# EasyEDA Pro project foc_board.eprj

# Schematic Schematic1
Board Name: Board1; Create Date: 2024-08-11; Page Name: P1; Project Name: foc_board; Schematic Name: Schematic1; Update Date: 2025-01-14; Company: 嘉立创EDA; Page Size: A4; Version: V1.0
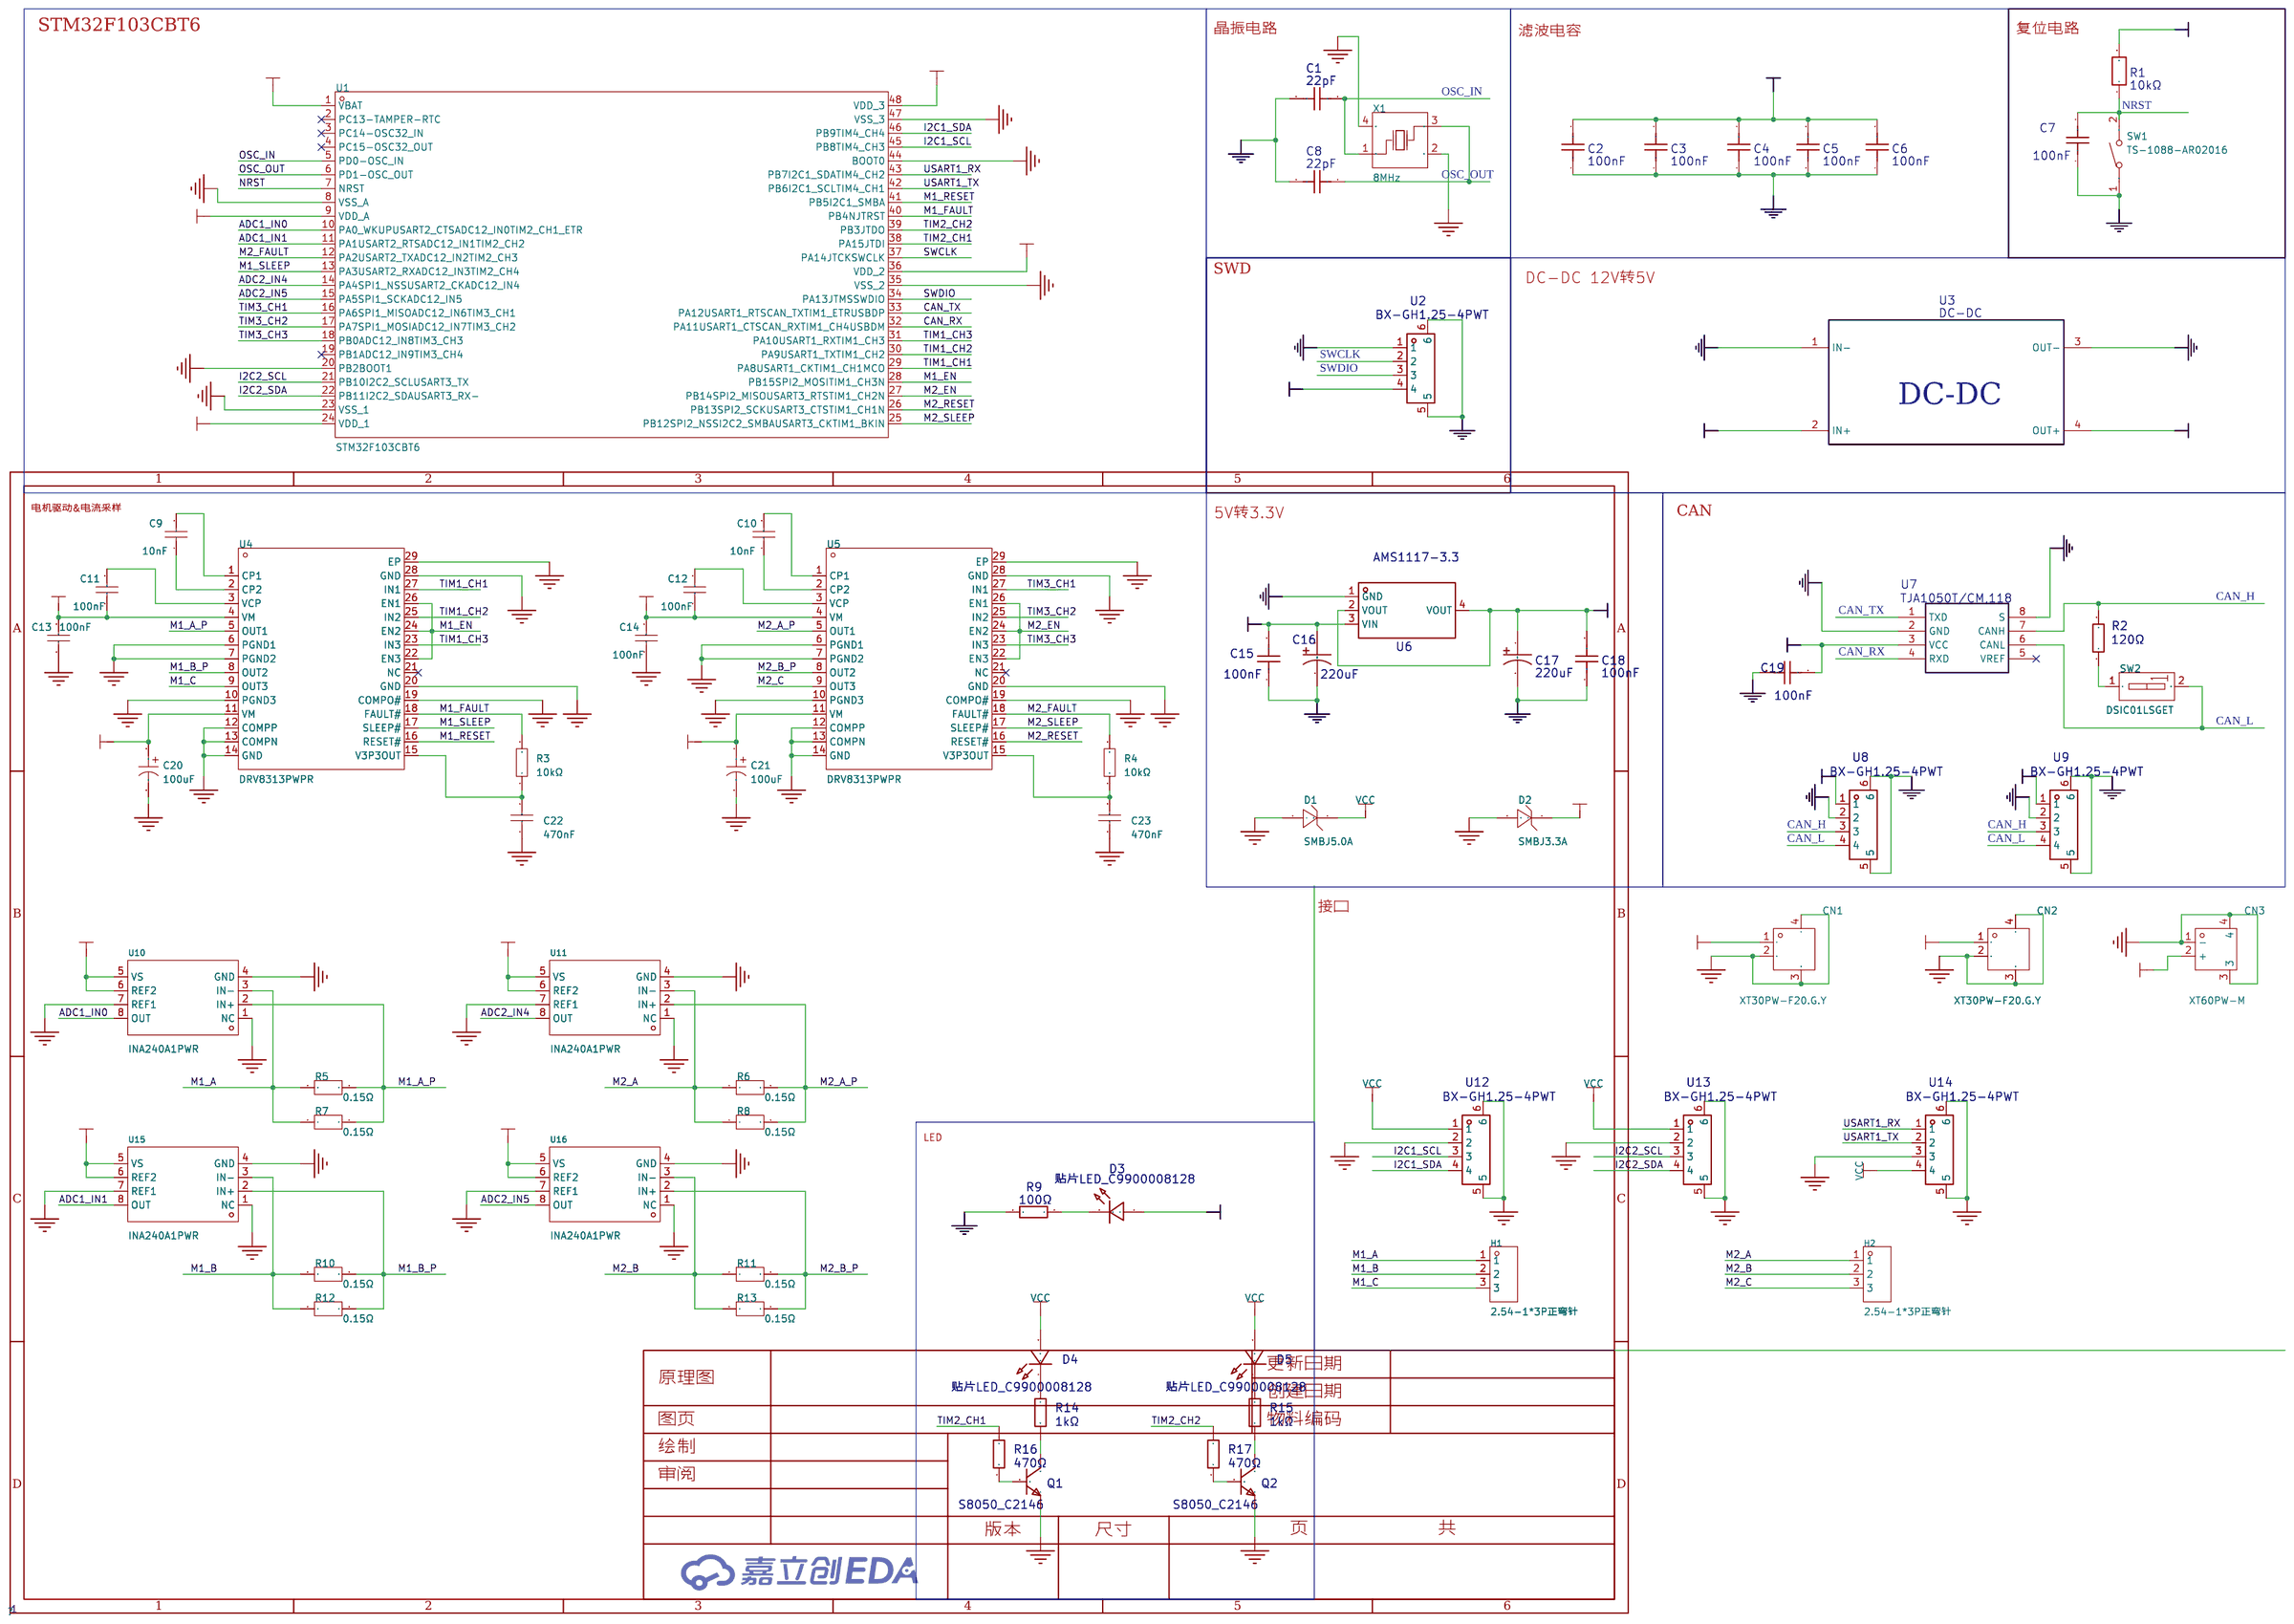
[diagram p0: schematic sheet]

## Parts
C1  22pF  [C0603]
C2  100nF  [C0603]
C3  100nF  [C0603]
C4  100nF  [C0603]
C5  100nF  [C0603]
C6  100nF  [C0603]
C7  100nF  [C0603]
C8  22pF  [C0603]
C9  10nF  [C0603]
C10  10nF  [C0603]
C11  100nF  [C0603]
C12  100nF  [C0603]
C13  100nF  [C0603]
C14  100nF  [C0603]
C15  100nF  [C0603]
C16  220uF  [CAP-SMD_BD6.3-L6.6-W6.6-FD]
C17  220uF  [CAP-SMD_BD6.3-L6.6-W6.6-FD]
C18  100nF  [C0603]
C19  100nF  [C0603]
C20  100uF  [CAP-SMD_BD6.3-L6.6-W6.6-LS7.4-FD]
C21  100uF  [CAP-SMD_BD6.3-L6.6-W6.6-LS7.4-FD]
C22  470nF  [C0603]
C23  470nF  [C0603]
CN1  XT30PW-F20.G.Y  [CONN-TH_XT30PW-F-1]
CN2  XT30PW-F20.G.Y  [CONN-TH_XT30PW-F-1]
CN3  XT60PW-M  [CONN-TH_XT60PW-M]
D1  SMBJ5.0A  [SMB_L4.6-W3.6-LS5.3-RD]
D2  SMBJ3.3A  [SMB_L4.6-W3.6-LS5.3-RD]
D3  贴片LED_C9900008128  [LED0603-RD]
D4  贴片LED_C9900008128  [LED0603-RD]
D5  贴片LED_C9900008128  [LED0603-RD]
H1  2.54-1*3P正弯针  [HDR-TH_3P-P2.54-H-M-BW7.2-P]
H2  2.54-1*3P正弯针  [HDR-TH_3P-P2.54-H-M-BW7.2-P]
Q1  S8050_C2146  [SOT-23-3_L3.0-W1.7-P0.95-LS2.9-BR]
Q2  S8050_C2146  [SOT-23-3_L3.0-W1.7-P0.95-LS2.9-BR]
R1  10kΩ  [R0603]
R2  120Ω  [R0805]
R3  10kΩ  [R0603]
R4  10kΩ  [R0603]
R5  0.15Ω  [R1812]
R6  0.15Ω  [R1812]
R7  0.15Ω  [R1812]
R8  0.15Ω  [R1812]
R9  100Ω  [R0805]
R10  0.15Ω  [R1812]
R11  0.15Ω  [R1812]
R12  0.15Ω  [R1812]
R13  0.15Ω  [R1812]
R14  1kΩ  [R0805]
R15  1kΩ  [R0805]
R16  470Ω  [R0805]
R17  470Ω  [R0805]
SW1  TS-1088-AR02016  [SW-SMD_L3.9-W3.0-P4.45]
SW2  DSIC01LSGET  [SW-SMD_DSIC01LSGET]
U1  STM32F103CBT6  [LQFP-48_L7.0-W7.0-P0.50-LS9.0-BL]
U2  BX-GH1.25-4PWT  [CONN-SMD_4P-P1.25_BX-GH1.25-4PWT]
U3  DC-DC  [DC-DC]
U4  DRV8313PWPR  [HTSSOP-28_L9.8-W4.5-P0.65-LS6.6-BL-EP]
U5  DRV8313PWPR  [HTSSOP-28_L9.8-W4.5-P0.65-LS6.6-BL-EP]
U6  AMS1117-3.3  [SOT-223-3_L6.5-W3.4-P2.30-LS7.0-BR]
U7  TJA1050T/CM,118  [SOIC-8_L5.0-W4.0-P1.27-LS6.0-BL]
U8  BX-GH1.25-4PWT  [CONN-SMD_4P-P1.25_BX-GH1.25-4PWT]
U9  BX-GH1.25-4PWT  [CONN-SMD_4P-P1.25_BX-GH1.25-4PWT]
U10  INA240A1PWR  [TSSOP-8_L4.4-W3.0-P0.65-LS6.4-BL]
U11  INA240A1PWR  [TSSOP-8_L4.4-W3.0-P0.65-LS6.4-BL]
U12  BX-GH1.25-4PWT  [CONN-SMD_4P-P1.25_BX-GH1.25-4PWT]
U13  BX-GH1.25-4PWT  [CONN-SMD_4P-P1.25_BX-GH1.25-4PWT]
U14  BX-GH1.25-4PWT  [CONN-SMD_4P-P1.25_BX-GH1.25-4PWT]
U15  INA240A1PWR  [TSSOP-8_L4.4-W3.0-P0.65-LS6.4-BL]
U16  INA240A1PWR  [TSSOP-8_L4.4-W3.0-P0.65-LS6.4-BL]
X1  8MHz  [OSC-SMD_4P-L5.0-W3.2-BL]

## Library data of the parts
C1 C8 = 22pF: Supplier: LCSC; Supplier Part: C2266794; Manufacturer: Knowles(楼氏); Manufacturer Part: 0603J0250104KXR; JLCPCB Part Class: Extended Part
C2-C7 C15 C18 C19 = 100nF: Supplier: LCSC; Supplier Part: C2266794; Manufacturer: Knowles(楼氏); Manufacturer Part: 0603J0250104KXR; JLCPCB Part Class: Extended Part
C9-C14 = CC0603KRX7R9BB103: LCSC Part Name: 10nF ±10% 50V; Supplier Part: C100042; Manufacturer: YAGEO(国巨); Supplier Footprint: 0603; JLCPCB Part Class: 扩展库; Datasheet: https://atta.szlcsc.com/upload/public/pdf/source/20181008/C309510_22F155564471FAF6A489F7D68F34234E.pdf; Supplier: LCSC; Tolerance: ±10%; Voltage Rated: 50V; Temperature Coefficient: X7R
C16 C17 = 220uF: Supplier: LCSC; Supplier Part: C165593; Manufacturer: SAMYOUNG(韩国三莹); Manufacturer Part: MVK 16V220M 6.3*8 6.3TP; JLCPCB Part Class: Extended Part
C20 C21 = RVT100UF35V67RV0034: LCSC Part Name: 100uF ±20% 35V; Supplier Part: C2836442; Manufacturer: KNSCHA(科尼盛); Supplier Footprint: SMD,D6.3xL7.7mm; JLCPCB Part Class: 扩展库; Datasheet: https://atta.szlcsc.com/upload/public/pdf/source/20210528/C2836442_7F6389BF36F63F32D6DF3A507E8E95D6.pdf; Supplier: LCSC; Tolerance: ±20%; Rated Voltage: 35V; Ripple Current: 87mA@120kHz; φD: 6.3mm; L: 7.7mm; Lifetime @ Temp: 2000hrs@105℃; Operating Temperature: -55℃~+105℃
C22 C23 = CL10B474KA8NNNC: LCSC Part Name: 470nF ±10% 25V; Supplier Part: C1623; Manufacturer: SAMSUNG(三星); Supplier Footprint: 0603; JLCPCB Part Class: 基础库; Datasheet: https://atta.szlcsc.com/upload/public/pdf/source/20160218/1457707763339.pdf; Supplier: LCSC; Tolerance: ±10%; Voltage Rated: 25V; Temperature Coefficient: X7R
CN1 CN2 = XT30PW-F20.G.Y: LCSC Part Name: AMASS(艾迈斯)电源连接器 母头 XT30PW-F; Supplier Part: C2913282; Manufacturer: AMASS(艾迈斯); JLCPCB Part Class: 扩展库; Datasheet: https://atta.szlcsc.com/upload/public/pdf/source/20231218/06CFCF98887A9A87638B0856A725C8FD.pdf; Supplier: LCSC; Type: 航模插头; InterfaceType: 母头
CN3 = XT60PW-M: LCSC Part Name: AMASS(艾迈斯)航模插头xt60连接器150公母对接pw锂电池公头 板插卧式XT60PW-M; Supplier Part: C98732; Manufacturer: AMASS(艾迈斯); JLCPCB Part Class: 扩展库; Datasheet: https://atta.szlcsc.com/upload/public/pdf/source/20240118/44A3DCFF53BE25DC65378AFFB21277A4.pdf; Supplier: LCSC; Brand: 艾迈斯; Type: 卧式插头; Colour: 黄色; InterfaceType: 公头
D1 = SMBJ5.0A_C113974: 反向截止电压(Vrwm):5V;最大钳位电压:9.2V;峰值脉冲电流(Ipp)@10/1000us:65.2A;击穿电压:6.4V;; LCSC Part Name: TVS 5V截止 65.22A峰值脉冲; Supplier Part: C113974; Manufacturer: MDD; Supplier Footprint: SMB(DO-214AA); JLCPCB Part Class: 扩展库; Datasheet: https://atta.szlcsc.com/upload/public/pdf/source/20230314/C8F66EF07395B88C11214ABD10019202.pdf; Supplier: LCSC; Reverse Stand-Off Voltage (Vrwm): 5V; Maximum Clamping Voltage: 9.2V; Peak Pulse Current (Ipp)@10/1000us: 65.2A; Breakdown Voltage: 6.4V; Type: TVS
D2 = SMBJ3.3A_C362089: 反向截止电压(Vrwm):3.3V;最大钳位电压:7.3V;峰值脉冲功率(Ppp)@10/1000us:600W;击穿电压:4.1V;; LCSC Part Name: 单向TVS 3.3V截止 600W峰值脉冲功率; Supplier Part: C113974; Manufacturer: JKSEMI(金开盛); Supplier Footprint: SMB(DO-214AA); JLCPCB Part Class: 扩展库; Datasheet: https://atta.szlcsc.com/upload/public/pdf/source/20200731/C362089_3B984BF84356FE4A5051ADB3F5B1E766.pdf; Supplier: LCSC; Reverse Stand-Off Voltage (Vrwm): 3.3V; Maximum Clamping Voltage: 7.3V; Peak Pulse Power Dissipation (Ppp)@10/1000us: 600W; Breakdown Voltage: 4.1V; Type: TVS
D3-D5 = 贴片LED_C9900008128: Supplier: LCSC; Supplier Part: C9900008128; Manufacturer: null; Manufacturer Part: 贴片LED
H1 H2 = 2.54-1*3P正弯针: LCSC Part Name: 间距:2.54mm 1x3P 弯插 方针; Supplier Part: C92159; Manufacturer: BOOMELE(博穆精密); Supplier Footprint: 弯插,P=2.54mm; JLCPCB Part Class: 扩展库; Datasheet: https://atta.szlcsc.com/upload/public/pdf/source/20181121/C2334_B051029C4931EB562F9DCCAAD18AC88A.pdf; Supplier: LCSC; Pin Structure: 1x3P; Pitch: 2.54mm; Circluar Pins/Square Pins: 方针; Mounting Type: 弯插; Number of Rows: 单排; Number of Pins: 3P; Current Rating (Max): 3A; Length of Mating Pin: 3mm; Insulation Height: 2.54mm; Operating Temperature Range: -55℃~+105℃; Color: 黑色
Q1 Q2 = S8050_C2146: Supplier: LCSC; Manufacturer: CJ(江苏长电/长晶); Manufacturer Part: S8050 J3Y; Supplier Part: C2146; JLCPCB Part Class: Basic Part
R1 = 10kΩ: Supplier: LCSC; Supplier Part: C20138101; Manufacturer: VISHAY(威世); Manufacturer Part: MCT0603MG1002BP500; JLCPCB Part Class: Extended Part
R2 = 120Ω: Supplier: LCSC; Manufacturer: YAGEO(国巨); Manufacturer Part: RC0805FR-07120RL; Supplier Part: C114245; JLCPCB Part Class: Extended Part
R3 R4 = 0603WAF1002T5E: LCSC Part Name: 厚膜电阻 10kΩ ±1% 100mW; Supplier Part: C25804; Manufacturer: UNI-ROYAL(厚声); Supplier Footprint: 0603; JLCPCB Part Class: 基础库; Datasheet: https://atta.szlcsc.com/upload/public/pdf/source/20200306/C422600_1E6D84923E4A46A82E41ADD87F860B5C.pdf; Supplier: LCSC; Type: 厚膜电阻; Tolerance: ±1%; Power(Watts): 100mW; Overload Voltage (Max): 75V; Temperature Coefficient: ±100ppm/℃; Operating Temperature Range: -55℃~+155℃
R5-R8 R10-R13 = FRC1812J101 TS: LCSC Part Name: 100Ω ±5% 750mW 厚膜电阻; Supplier Part: C2933911; Manufacturer: FOJAN(富捷); Supplier Footprint: 1812; JLCPCB Part Class: 扩展库; Datasheet: https://atta.szlcsc.com/upload/public/pdf/source/20211221/925EC7D7225764EE0046F22065062C87.pdf; Supplier: LCSC; Type: 厚膜电阻; Tolerance: ±5%; Power(Watts): 750mW; Overload Voltage (Max): 200V; Temperature Coefficient: ±100ppm/℃; Operating Temperature Range: -55℃~+155℃
R9 R14-R17 = 1kΩ: Supplier: LCSC; Manufacturer: YAGEO(国巨); Manufacturer Part: RC0805FR-07120RL; Supplier Part: C114245; JLCPCB Part Class: Extended Part
SW1 = TS-1088-AR02016: 电路结构:单刀单掷;按钮形状:圆形按钮;作用力:160gf;安装方式:立贴;开关长度:4mm;开关宽度:3mm;开关高度:2mm;带支架:不带;触点电流:50mA;额定电压(DC):12V;绝缘电阻:100MΩ;机械寿命:10万次;; LCSC Part Name: 4*3*2mm 立贴 轻触开关; Supplier Part: C720477; Manufacturer: XUNPU(讯普); Supplier Footprint: SMD; JLCPCB Part Class: 扩展库; Datasheet: https://atta.szlcsc.com/upload/public/pdf/source/20200810/C720475_60D09DD6C54279ADDB2DC25100F1CC11.pdf; Supplier: LCSC; Circuit: 单刀单掷; Actuator Style: 圆形按钮; Operating Force: 160gf; Mounting Style: 立贴; Switch Length: 4mm; Switch Width: 3mm; Switch Height: 2mm; Strike Gundam: 不带; Contact Current: 50mA; Voltage Rating (DC): 12V; Insulation Resistance: 100MΩ; Actuator/Cap Color: 黑色; Pin Style: SMD接片; Mechanical Life: 10万次; Operating Temperature: -30℃~+80℃
SW2 = DSIC01LSGET_C54948: LCSC Part Name: 1位高推 拨码开关; Supplier Part: C54948; Manufacturer: YE; Supplier Footprint: SMD,2.5x6mm; JLCPCB Part Class: 扩展库; Datasheet: https://atta.szlcsc.com/upload/public/pdf/source/20150928/1457707425459.pdf; Supplier: LCSC; Type: 平拨,凸起式; Circuit: 单刀单掷; Number of Positions: 1位; Color: 黑色
U1 = STM32F103CBT6: LCSC Part Name: 主流增强型ARM Cortex-M3 MCU，具有128 KB Flash、72 MHz CPU、电机控制、USB和CAN; Supplier Part: C8304; Manufacturer: ST(意法半导体); Supplier Footprint: LQFP-48(7x7); JLCPCB Part Class: 扩展库; Datasheet: https://atta.szlcsc.com/upload/public/pdf/source/20150811/1457707344439.pdf; Supplier: LCSC; CPU Core: ARM-M3; Program Storage Size: 128KB; RAM Size: 20KB; GPIO Ports Number: 37; Operating Voltage Range: 2V~3.6V; CPU Maximum Speed: 72MHz; Program Memory Type: FLASH; Operating Temperature Range: -40℃~+85℃; ADC (Bit): 12bit; Universal Serial Bus: 有; Peripheral/Function: DMA；温度传感器；PWM; Watchdog: 有; Infrared Data Association: 有; Low-Voltage Detect: 有; Direct Memory Access: 有; Internal Oscillator: 有
U2 U8 U9 U12-U14 = BX-GH1.25-4PWT: Supplier: LCSC; Supplier Part: C18077720; Manufacturer: Bossie(博锡); JLCPCB Part Class: Extended Part
U3 = DC-DC: Supplier Part: C2875440
U4 U5 = DRV8313PWPR: LCSC Part Name: 无刷直流BLDC电机驱动芯片 60V; Supplier Part: C92482; Manufacturer: TI(德州仪器); Supplier Footprint: HTSSOP-28-EP-4.5mm; JLCPCB Part Class: 扩展库; Datasheet: https://www.ti.com/cn/lit/gpn/drv8313; Supplier: LCSC
U6 = AMS1117-3.3: Supplier: LCSC; Manufacturer: AMS; Supplier Part: C6186; JLCPCB Part Class: Basic Part
U7 = TJA1050T/CM,118: Supplier: LCSC; Manufacturer: NXP(恩智浦); Supplier Part: C6952; JLCPCB Part Class: Extended Part
U10 U11 U15 U16 = INA240A1PWR: Supplier Part: C93965; Manufacturer: TI(德州仪器); Supplier Footprint: TSSOP-8; JLCPCB Part Class: 扩展库; Datasheet: https://www.ti.com/cn/lit/gpn/ina240; Supplier: LCSC; Number of Channels: 单路; Supply Current: 1.8mA; Operating Temperature: -40℃~+125℃
X1 = X50328MSB4SI: LCSC Part Name: 8MHz ±10ppm 20pF; Supplier Part: C157341; Manufacturer: YXC(扬兴晶振); Supplier Footprint: SMD5032-4P; JLCPCB Part Class: 扩展库; Datasheet: https://atta.szlcsc.com/upload/public/pdf/source/20240329/327CA683A00C8316374FE0D2B6DB5109.pdf; Supplier: LCSC; Crystal Type: 贴片晶振; Normal temperature Frequency Tolerance: ±10ppm; External load capacitor: 20pF; Frequency Stability(Full temperature range): ±20ppm; Operating Temperature: -40℃~+85℃

## Nets
GND: C1.2 C2.1 C3.1 C4.1 C5.1 C6.1 C7.1 C8.2 C15.1 C16.2 C17.2 C18.1 C19.2 C22.1 C23.1 D1.2(A) D2.2 Q1.2(E) Q2.2(E) R9.2 SW1.1 U1.8(VSS_A) U1.20(PB2BOOT1) U1.23(VSS_1) U1.35(VSS_2) U1.44(BOOT0) U1.47(VSS_3) U2.1 U2.5 U2.6 U3.3(OUT-) U4.12(COMPP) U4.13(COMPN) U4.14(GND) U4.19(COMPO#) U4.20(GND) U4.28(GND) U5.12(COMPP) U5.13(COMPN) U5.14(GND) U5.19(COMPO#) U5.20(GND) U5.28(GND) U6.1(GND) U7.2(GND) U7.8(S) U8.2 U8.5 U8.6 U9.2 U9.5 U9.6 U10.1(NC) U10.4(GND) U10.7(REF1) U11.1(NC) U11.4(GND) U11.7(REF1) U12.2 U12.5 U12.6 U13.2 U13.5 U13.6 U14.3 U14.5 U14.6 U15.1(NC) U15.4(GND) U15.7(REF1) U16.1(NC) U16.4(GND) U16.7(REF1) X1.2(GND) X1.4(GND)
PGND: C13.1 C14.1 C20.2 C21.2 CN1.2 CN1.3 CN1.4 CN2.2 CN2.3 CN2.4 CN3.1(-) CN3.3 CN3.4 U3.1(IN-) U4.6(PGND1) U4.7(PGND2) U4.10(PGND3) U4.29(EP) U5.6(PGND1) U5.7(PGND2) U5.10(PGND3) U5.29(EP)
VCC: C15.2 C16.1 C19.1 D1.1(C) D3.2 D4.2 D5.2 U3.4(OUT+) U6.3(VIN) U7.3(VCC) U8.1 U9.1 U12.1 U13.1 U14.4
VCC3.3: C2.2 C3.2 C4.2 C5.2 C6.2 C17.1 C18.2 D2.1 R1.2 U1.1(VBAT) U1.9(VDD_A) U1.24(VDD_1) U1.36(VDD_2) U1.48(VDD_3) U2.4 U6.2(VOUT) U6.4(VOUT) U10.5(VS) U10.6(REF2) U11.5(VS) U11.6(REF2) U15.5(VS) U15.6(REF2) U16.5(VS) U16.6(REF2)
VCC12V: C11.1 C12.1 C13.2 C14.2 C20.1 C21.1 CN1.1 CN2.1 CN3.2(+) U3.2(IN+) U4.4(VM) U4.11(VM) U5.4(VM) U5.11(VM)
ADC1_IN0: U1.10(PA0_WKUPUSART2_CTSADC12_IN0TIM2_CH1_ETR) U10.8(OUT)
ADC1_IN1: U1.11(PA1USART2_RTSADC12_IN1TIM2_CH2) U15.8(OUT)
ADC2_IN4: U1.14(PA4SPI1_NSSUSART2_CKADC12_IN4) U11.8(OUT)
ADC2_IN5: U1.15(PA5SPI1_SCKADC12_IN5) U16.8(OUT)
CAN_H: R2.2 U7.7(CANH) U8.3 U9.3
CAN_L: SW2.2(A2) U7.6(CANL) U8.4 U9.4
CAN_RX: U1.32(PA11USART1_CTSCAN_RXTIM1_CH4USBDM) U7.4(RXD)
CAN_TX: U1.33(PA12USART1_RTSCAN_TXTIM1_ETRUSBDP) U7.1(TXD)
I2C1_SCL: U1.45(PB8TIM4_CH3) U12.3
I2C1_SDA: U1.46(PB9TIM4_CH4) U12.4
I2C2_SCL: U1.21(PB10I2C2_SCLUSART3_TX) U13.3
I2C2_SDA: U1.22(PB11I2C2_SDAUSART3_RX-) U13.4
M1_A: H1.1 R5.1 R7.1 U10.3(IN-)
M1_A_P: R5.2 R7.2 U4.5(OUT1) U10.2(IN+)
M1_B: H1.2 R10.1 R12.1 U15.3(IN-)
M1_B_P: R10.2 R12.2 U4.8(OUT2) U15.2(IN+)
M1_C: H1.3 U4.9(OUT3)
M1_EN: U1.28(PB15SPI2_MOSITIM1_CH3N) U4.22(EN3) U4.24(EN2) U4.26(EN1)
M1_FAULT: R3.2 U1.40(PB4NJTRST) U4.18(FAULT#)
M1_RESET: U1.41(PB5I2C1_SMBA) U4.16(RESET#)
M1_SLEEP: U1.13(PA3USART2_RXADC12_IN3TIM2_CH4) U4.17(SLEEP#)
M2_A: H2.1 R6.1 R8.1 U11.3(IN-)
M2_A_P: R6.2 R8.2 U5.5(OUT1) U11.2(IN+)
M2_B: H2.2 R11.1 R13.1 U16.3(IN-)
M2_B_P: R11.2 R13.2 U5.8(OUT2) U16.2(IN+)
M2_C: H2.3 U5.9(OUT3)
M2_EN: U1.27(PB14SPI2_MISOUSART3_RTSTIM1_CH2N) U5.22(EN3) U5.24(EN2) U5.26(EN1)
M2_FAULT: R4.2 U1.12(PA2USART2_TXADC12_IN2TIM2_CH3) U5.18(FAULT#)
M2_RESET: U1.26(PB13SPI2_SCKUSART3_CTSTIM1_CH1N) U5.16(RESET#)
M2_SLEEP: U1.25(PB12SPI2_NSSI2C2_SMBAUSART3_CKTIM1_BKIN) U5.17(SLEEP#)
NRST: C7.2 R1.1 SW1.2 U1.7(NRST)
OSC_IN: C1.1 U1.5(PD0-OSC_IN) X1.1(OSC1)
OSC_OUT: C8.1 U1.6(PD1-OSC_OUT) X1.3(OSC2)
SWCLK: U1.37(PA14JTCKSWCLK) U2.2
SWDIO: U1.34(PA13JTMSSWDIO) U2.3
TIM1_CH1: U1.29(PA8USART1_CKTIM1_CH1MCO) U4.27(IN1)
TIM1_CH2: U1.30(PA9USART1_TXTIM1_CH2) U4.25(IN2)
TIM1_CH3: U1.31(PA10USART1_RXTIM1_CH3) U4.23(IN3)
TIM2_CH1: R16.1 U1.38(PA15JTDI)
TIM2_CH2: R17.1 U1.39(PB3JTDO)
TIM3_CH1: U1.16(PA6SPI1_MISOADC12_IN6TIM3_CH1) U5.27(IN1)
TIM3_CH2: U1.17(PA7SPI1_MOSIADC12_IN7TIM3_CH2) U5.25(IN2)
TIM3_CH3: U1.18(PB0ADC12_IN8TIM3_CH3) U5.23(IN3)
USART1_RX: U1.43(PB7I2C1_SDATIM4_CH2) U14.1
USART1_TX: U1.42(PB6I2C1_SCLTIM4_CH1) U14.2
$1N3655: R2.1 SW2.1(A1)
$1N7193: C9.2 U4.1(CP1)
$1N7199: C9.1 U4.2(CP2)
$1N7239: C11.2 U4.3(VCP)
$1N7723: C22.2 R3.1 U4.15(V3P3OUT)
$1N8422: C10.2 U5.1(CP1)
$1N8426: C10.1 U5.2(CP2)
$1N8429: C12.2 U5.3(VCP)
$1N8490: C23.2 R4.1 U5.15(V3P3OUT)
$1N11780: D3.1 R9.1
$1N11915: Q2.3(C) R15.2
$1N11916: D5.1 R15.1
$1N11923: Q2.1(B) R17.2
$1N12054: Q1.3(C) R14.2
$1N12055: D4.1 R14.1
$1N12058: Q1.1(B) R16.2

Not connected (* = marked no-connect by the designer): U1 2(PC13-TAMPER-RTC)* 3(PC14-OSC32_IN)* 4(PC15-OSC32_OUT)* 19(PB1ADC12_IN9TIM3_CH4)*; U4 21(NC)*; U5 21(NC)*; U7 5(VREF)*

## Notes on the sheet
- STM32F103CBT6
- 晶振电路
- 滤波电容
- 复位电路
- SWD
- DC-DC 12V转5V
- 电机驱动&电流采样
- 5V转3.3V
- CAN
- 接口
- LED

# Board PCB1
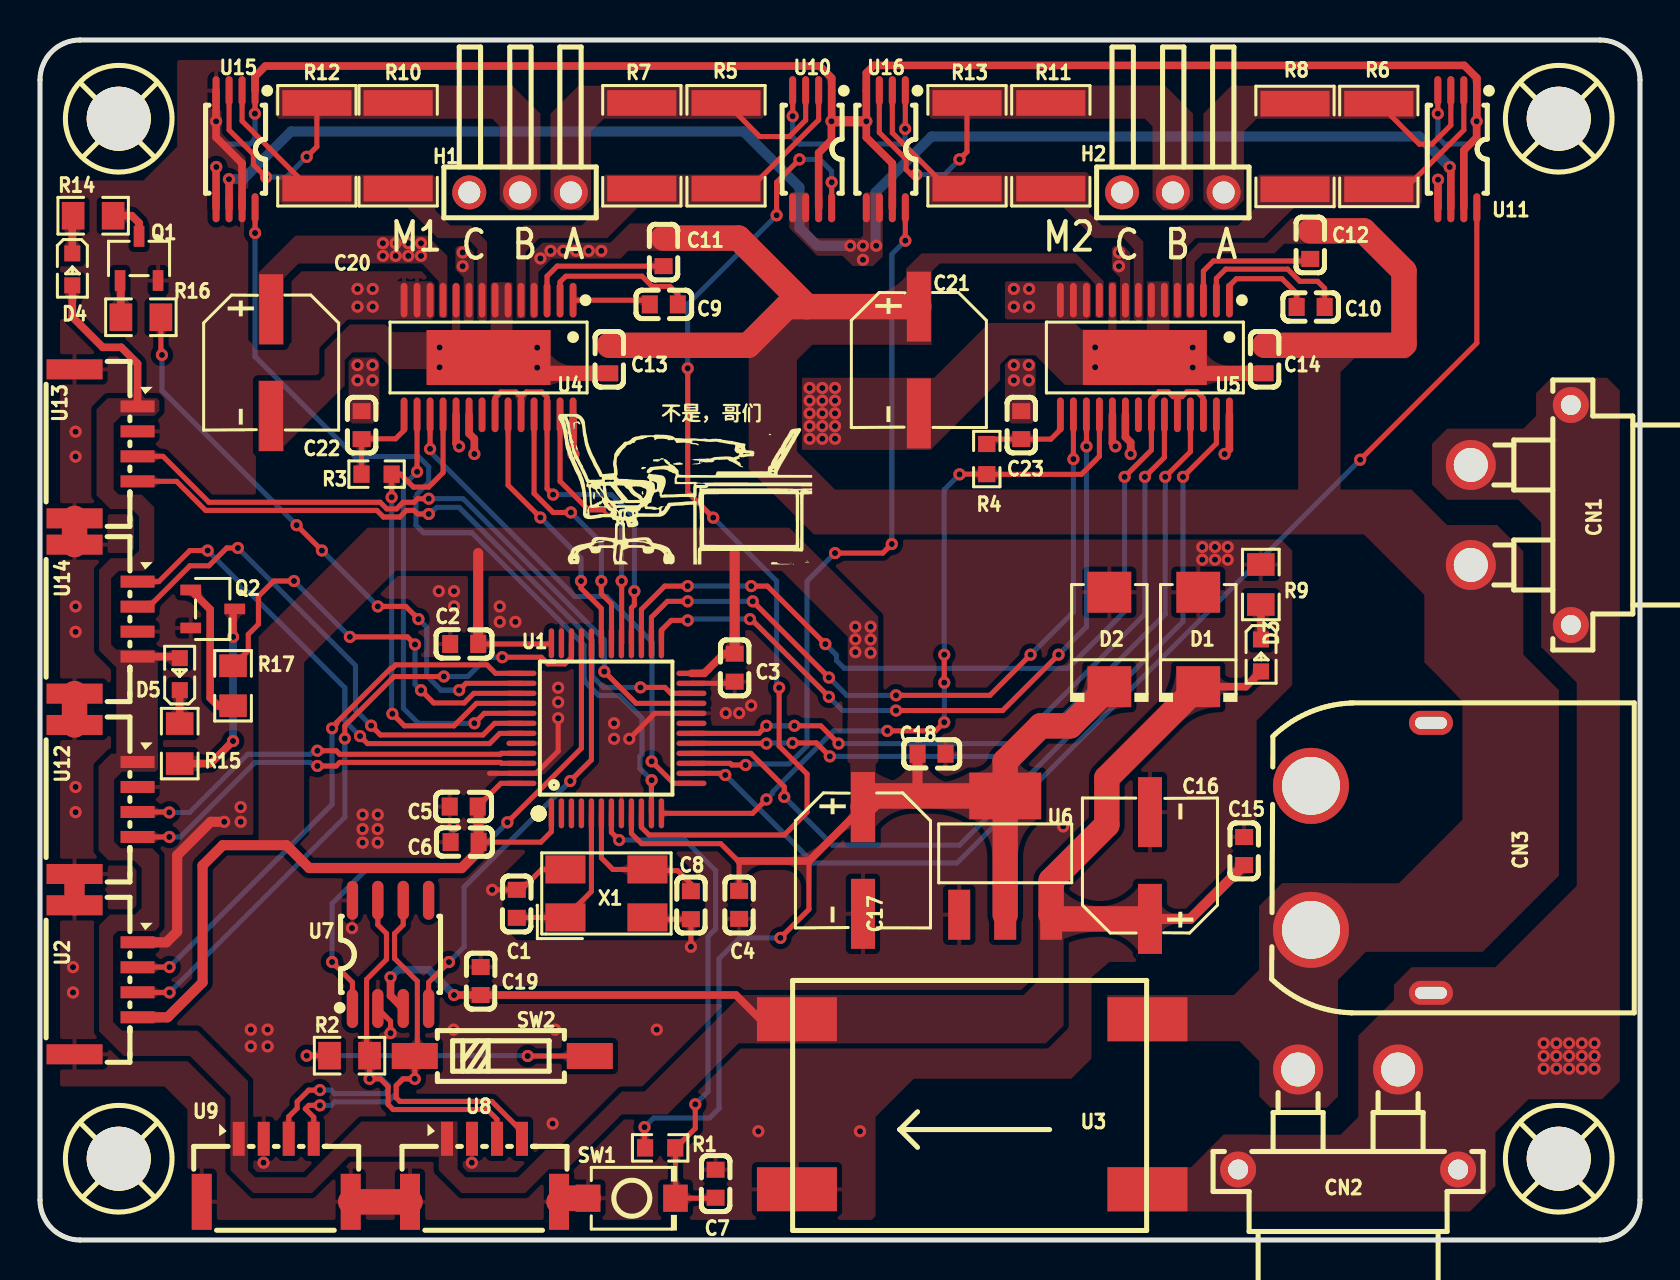
[diagram p1: board, top side]
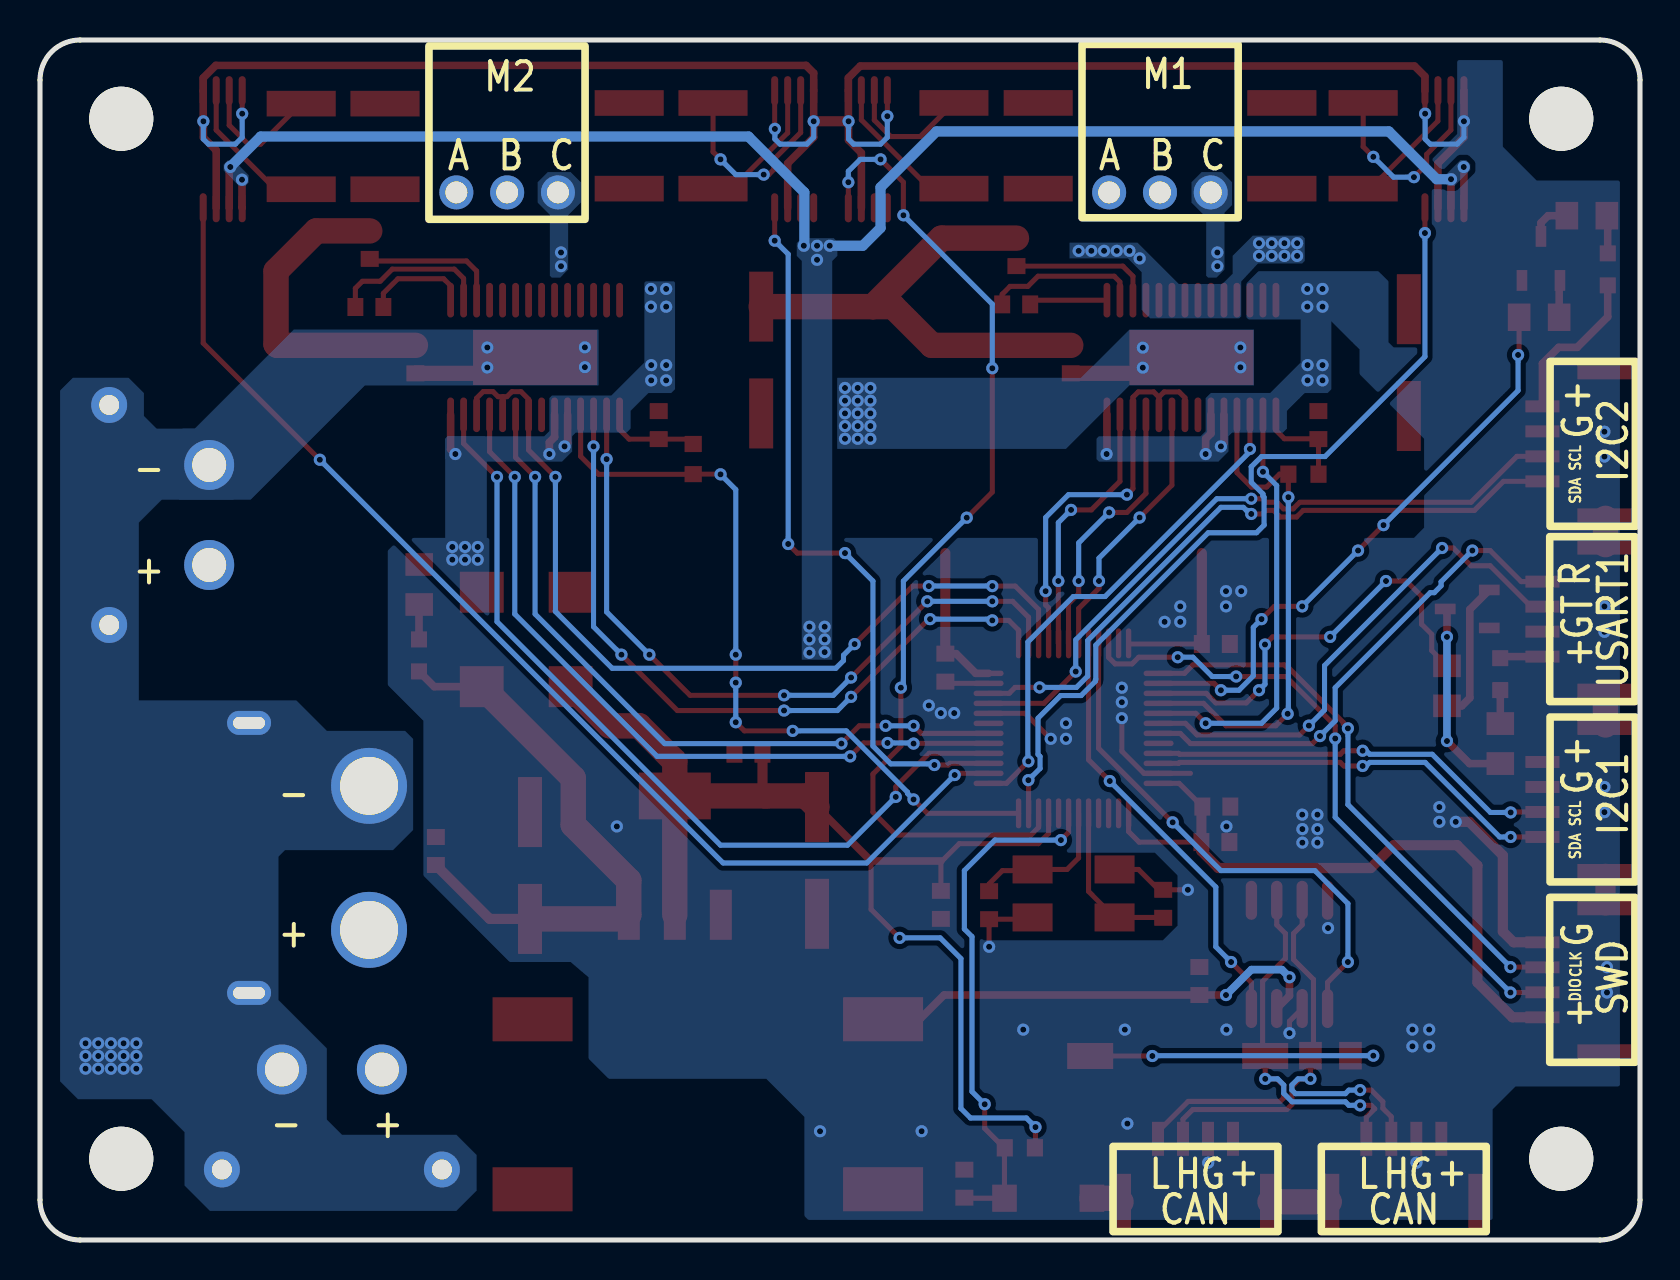
[diagram p2: board, bottom side, seen from below]

Outline 80 x 60 mm; copper layers: Top Layer, Bottom Layer. Coordinates in mm from the lower left corner of the outline.
Outline path: 0,58 0,2 arc(0.59,0.59) 2,0 78,0 arc(79.41,0.59) 80,2 80,58 arc(79.41,59.41) 78,60 2,60 arc(0.59,59.41) 0,58
Stack: Top Layer 0.035mm / Dielectric1 1.51mm FR4 er 4.5 / Bottom Layer 0.035mm

## Design rules (mm)
net OSC_IN: DP1
net OSC_OUT: DP1
net CAN_H: DP4
net CAN_L: DP4
net I2C2_SCL: DP2
net I2C2_SDA: DP2
net I2C1_SCL: DP3
net I2C1_SDA: DP3
template: 自定义配置
spacing copperThickness1oz: track to track 0.102, other pairs 0.152 to 0.3
spacing copperThickness2oz: track to track 0.203, other pairs 0.152 to 0.3
spacing Default (default): track to track 0.152, other pairs 0 to 1.001
track width copperThickness1oz: min 0.127, default 0.254, max 2.54
track width copperThickness2oz: min 0.203, default 0.254, max 2.54
track width Default (default): min 0.254, default 0.254, max 25.4
differential pair differentialPair (default): width min 0.127, default 0.254, max 2.54; gap min 0.152, default 0.152
via viaSize (default): diameter min 0.5, default 0.61, max 10; hole min 0.3, default 0.305, max 6.3
via Default: diameter min 0.61, default 0.61, max 100.025; hole min 0.305, default 0.305, max 59.995
net GND uses Default

## Placement (name value [footprint] x y rotation side)
C1  22pF  [C0603]  23.84 16.81 90 top
C2  100nF  [C0603]  21.21 29.8 0 top
C3  100nF  [C0603]  34.73 28.62 90 top
C4  100nF  [C0603]  34.96 16.76 90 top
C5  100nF  [C0603]  21.19 21.67 0 top
C6  100nF  [C0603]  21.23 19.89 0 top
C7  100nF  [C0603]  33.78 2.81 270 top
C8  22pF  [C0603]  32.54 16.74 270 top
C9  10nF  [C0603]  31.19 46.78 180 top
C10  10nF  [C0603]  63.53 46.65 180 top
C11  100nF  [C0603]  31.18 49.39 270 top
C12  100nF  [C0603]  63.51 49.75 270 top
C13  100nF  [C0603]  28.46 44.03 90 top
C14  100nF  [C0603]  61.23 44.03 90 top
C15  100nF  [C0603]  60.21 19.45 270 top
C16  220uF  [CAP-SMD_BD6.3-L6.6-W6.6-FD]  55.5 18.72 90 top
C17  220uF  [CAP-SMD_BD6.3-L6.6-W6.6-FD]  41.15 18.98 270 top
C18  100nF  [C0603]  44.58 24.31 180 top
C19  100nF  [C0603]  22.03 12.95 90 top
C20  100uF  [CAP-SMD_BD6.3-L6.6-W6.6-LS7.4-FD]  11.56 43.87 270 top
C21  100uF  [CAP-SMD_BD6.3-L6.6-W6.6-LS7.4-FD]  43.94 44 270 top
C22  470nF  [C0603]  16.08 40.74 270 top
C23  470nF  [C0603]  49.06 40.74 270 top
CN1  XT30PW-F20.G.Y  [CONN-TH_XT30PW-F-1]  74.04 36.25 90 top
CN2  XT30PW-F20.G.Y  [CONN-TH_XT30PW-F-1]  65.41 6.03 0 top
CN3  XT60PW-M  [CONN-TH_XT60PW-M]  66.55 19.11 180 top
D1  SMBJ5.0A  [SMB_L4.6-W3.6-LS5.3-RD]  57.91 30.03 90 top
D2  SMBJ3.3A  [SMB_L4.6-W3.6-LS5.3-RD]  53.47 30.03 90 top
D3  贴片LED_C9900008128  [LED0603-RD]  61.05 29.23 270 top
D4  贴片LED_C9900008128  [LED0603-RD]  1.61 48.53 270 top
D5  贴片LED_C9900008128  [LED0603-RD]  6.99 28.29 90 top
H1  2.54-1*3P正弯针  [HDR-TH_3P-P2.54-H-M-BW7.2-P]  24 52.38 180 top
H2  2.54-1*3P正弯针  [HDR-TH_3P-P2.54-H-M-BW7.2-P]  56.64 52.38 180 top
Q1  S8050_C2146  [SOT-23-3_L3.0-W1.7-P0.95-LS2.9-BR]  4.95 49.08 270 top
Q2  S8050_C2146  [SOT-23-3_L3.0-W1.7-P0.95-LS2.9-BR]  8.64 31.55 180 top
R1  10kΩ  [R0603]  31.01 4.61 180 top
R2  120Ω  [R0805]  15.48 9.22 0 top
R3  10kΩ  [R0603]  16.83 38.29 0 top
R4  10kΩ  [R0603]  47.34 39.05 270 top
R5  0.15Ω  [R1812]  34.3 54.71 270 top
R6  0.15Ω  [R1812]  66.94 54.68 270 top
R7  0.15Ω  [R1812]  30.09 54.71 270 top
R8  0.15Ω  [R1812]  62.75 54.68 270 top
R9  100Ω  [R0805]  61.04 32.77 90 top
R10  0.15Ω  [R1812]  17.91 54.71 270 top
R11  0.15Ω  [R1812]  50.54 54.71 270 top
R12  0.15Ω  [R1812]  13.84 54.71 270 top
R13  0.15Ω  [R1812]  46.35 54.71 270 top
R14  1kΩ  [R0805]  2.66 51.21 0 top
R15  1kΩ  [R0805]  6.98 24.82 270 top
R16  470Ω  [R0805]  5.04 46.14 180 top
R17  470Ω  [R0805]  9.65 27.71 270 top
SCREW1  -  [M3螺丝]  4 4 0 top
SCREW2  -  [M3螺丝]  4 56 0 top
SCREW3  -  [M3螺丝]  76 56 0 top
SCREW4  -  [M3螺丝]  76 4 0 top
SW1  TS-1088-AR02016  [SW-SMD_L3.9-W3.0-P4.45]  29.59 2.09 0 top
SW2  DSIC01LSGET  [SW-SMD_DSIC01LSGET]  23.11 9.2 270 top
U1  STM32F103CBT6  [LQFP-48_L7.0-W7.0-P0.50-LS9.0-BL]  28.32 25.58 0 top
U2  BX-GH1.25-4PWT  [CONN-SMD_4P-P1.25_BX-GH1.25-4PWT]  3.3 13.01 270 top
U3  -  [DC-DC]  46.61 6.79 180 top
U4  DRV8313PWPR  [HTSSOP-28_L9.8-W4.5-P0.65-LS6.6-BL-EP]  22.43 44.12 180 top
U5  DRV8313PWPR  [HTSSOP-28_L9.8-W4.5-P0.65-LS6.6-BL-EP]  55.25 44.12 180 top
U6  AMS1117-3.3  [SOT-223-3_L6.5-W3.4-P2.30-LS7.0-BR]  48.26 19.23 270 top
U7  TJA1050T/CM,118  [SOIC-8_L5.0-W4.0-P1.27-LS6.0-BL]  17.53 14.28 0 top
U8  BX-GH1.25-4PWT  [CONN-SMD_4P-P1.25_BX-GH1.25-4PWT]  22.22 3.49 0 top
U9  BX-GH1.25-4PWT  [CONN-SMD_4P-P1.25_BX-GH1.25-4PWT]  11.81 3.49 0 top
U10  INA240A1PWR  [TSSOP-8_L4.4-W3.0-P0.65-LS6.4-BL]  38.61 54.54 180 top
U11  INA240A1PWR  [TSSOP-8_L4.4-W3.0-P0.65-LS6.4-BL]  70.87 54.54 180 top
U12  BX-GH1.25-4PWT  [CONN-SMD_4P-P1.25_BX-GH1.25-4PWT]  3.3 22.03 270 top
U13  BX-GH1.25-4PWT  [CONN-SMD_4P-P1.25_BX-GH1.25-4PWT]  3.3 39.81 270 top
U14  BX-GH1.25-4PWT  [CONN-SMD_4P-P1.25_BX-GH1.25-4PWT]  3.3 31.04 270 top
U15  INA240A1PWR  [TSSOP-8_L4.4-W3.0-P0.65-LS6.4-BL]  9.78 54.54 180 top
U16  INA240A1PWR  [TSSOP-8_L4.4-W3.0-P0.65-LS6.4-BL]  42.29 54.54 180 top
X1  8MHz  [OSC-SMD_4P-L5.0-W3.2-BL]  28.32 17.33 0 top

## Footprints (pads in the part's own frame, mm; a bottom-side part is the same pattern mirrored in y, then rotated)
C0603
  rect 0.8x0.9 smd: 1(-0.7,0) 2(0.7,0)
CAP-SMD_BD6.3-L6.6-W6.6-FD
  rect 3.5x1.2 smd: 1(-2.67,0) 2(2.67,0)
CAP-SMD_BD6.3-L6.6-W6.6-LS7.4-FD
  rect 3.5x1.2 smd: 1(-2.67,0) 2(2.67,0)
CONN-SMD_4P-P1.25_BX-GH1.25-4PWT
  rect 0.6x1.7 smd: 1(-1.875,1.575) 2(-0.625,1.575) 3(0.625,1.575) 4(1.875,1.575)
  rect 1x2.8 smd: 5(3.725,-1.575) 6(-3.725,-1.575)
CONN-TH_XT30PW-F-1
  round 2.5 hole 1.7: 1(-2.5,2.5) 2(2.5,2.5)
  round 1.8 hole 1: 3(5.5,-2.5) 4(-5.5,-2.5)
CONN-TH_XT60PW-M
  round 3.8 hole 2.9: 1(3,-3.6) 2(3,3.6)
  oval 2.2x1.2 hole 1.6x0.6: 3(-3,6.75) 4(-3,-6.75)
DC-DC
  rect 4x2.2 smd: 1(-8.763,4.25) 2(-8.763,-4.25) 3(8.763,4.25) 4(8.763,-4.25)
HDR-TH_3P-P2.54-H-M-BW7.2-P
  round 1.7 hole 1.1: 1(-2.54,0) 2(0,0) 3(2.54,0)
HTSSOP-28_L9.8-W4.5-P0.65-LS6.6-BL-EP
  oval 0.343x1.732 smd: 1(-4.225,-2.866) 2(-3.575,-2.866) 3(-2.925,-2.866) 4(-2.275,-2.866) 5(-1.625,-2.866) 6(-0.975,-2.866) 7(-0.325,-2.866) 8(0.325,-2.866) 9(0.975,-2.866) 10(1.625,-2.866) 11(2.275,-2.866) 12(2.925,-2.866) 13(3.575,-2.866) 14(4.225,-2.866) 15(4.225,2.866) 16(3.575,2.866) 17(2.925,2.866) 18(2.275,2.866) 19(1.625,2.866) 20(0.975,2.866) 21(0.325,2.866) 22(-0.325,2.866) 23(-0.975,2.866) 24(-1.625,2.866) 25(-2.275,2.866) 26(-2.925,2.866) 27(-3.575,2.866) 28(-4.225,2.866)
  rect 6.2x2.75 smd: 29(0,0)
LED0603-RD
  rect 0.8x0.8 smd: 1(-0.799,0) 2(0.799,0)
LQFP-48_L7.0-W7.0-P0.50-LS9.0-BL
  oval 0.27x1.5 smd: 1(-2.75,-4.25) 2(-2.25,-4.25) 3(-1.75,-4.25) 4(-1.25,-4.25) 5(-0.75,-4.25) 6(-0.25,-4.25) 7(0.25,-4.25) 8(0.75,-4.25) 9(1.25,-4.25) 10(1.75,-4.25) 11(2.25,-4.25) 12(2.75,-4.25) 25(2.75,4.25) 26(2.25,4.25) 27(1.75,4.25) 28(1.25,4.25) 29(0.75,4.25) 30(0.25,4.25) 31(-0.25,4.25) 32(-0.75,4.25) 33(-1.25,4.25) 34(-1.75,4.25) 35(-2.25,4.25) 36(-2.75,4.25)
  oval 1.5x0.27 smd: 13(4.25,-2.75) 14(4.25,-2.25) 15(4.25,-1.75) 16(4.25,-1.25) 17(4.25,-0.75) 18(4.25,-0.25) 19(4.25,0.25) 20(4.25,0.75) 21(4.25,1.25) 22(4.25,1.75) 23(4.25,2.25) 24(4.25,2.75) 37(-4.25,2.75) 38(-4.25,2.25) 39(-4.25,1.75) 40(-4.25,1.25) 41(-4.25,0.75) 42(-4.25,0.25) 43(-4.25,-0.25) 44(-4.25,-0.75) 45(-4.25,-1.25) 46(-4.25,-1.75) 47(-4.25,-2.25) 48(-4.25,-2.75)
M3螺丝
  round 3.2 hole 3.2: 1(-0.064,0.064)
OSC-SMD_4P-L5.0-W3.2-BL
  rect 2x1.4 smd: 1(-2.05,-1.2) 2(2.05,-1.2) 3(2.05,1.2) 4(-2.05,1.2)
R0603
  rect 0.806x0.864 smd: 1(-0.753,0) 2(0.753,0)
R0805
  rect 1.133x1.377 smd: 1(-1,0) 2(1,0)
R1812
  rect 1.282x3.456 smd: 1(-2.141,0) 2(2.141,0)
SMB_L4.6-W3.6-LS5.3-RD
  rect 2.047x2.192 smd: 1(-2.361,0) 2(2.361,0)
SOIC-8_L5.0-W4.0-P1.27-LS6.0-BL
  oval 0.569x1.95 smd: 1(-1.905,-2.705) 2(-0.635,-2.705) 3(0.635,-2.705) 4(1.905,-2.705) 5(1.905,2.705) 6(0.635,2.705) 7(-0.635,2.705) 8(-1.905,2.705)
SOT-23-3_L3.0-W1.7-P0.95-LS2.9-BR
  rect 1.038x0.532 smd: 1(1.101,-0.95) 2(1.101,0.95) 3(-1.101,0)
SOT-223-3_L6.5-W3.4-P2.30-LS7.0-BR
  rect 2.5x1.1 smd: 1(2.97,-2.3) 2(2.97,0) 3(2.97,2.3)
  rect 2.34x3.6 smd: 4(-2.97,0)
SW-SMD_DSIC01LSGET
  rect 1.3x2.3 smd: 1(0,4.375) 2(0,-4.375)
SW-SMD_L3.9-W3.0-P4.45
  rect 1.23x1.36 smd: 1(-2.185,0) 2(2.185,0)
TSSOP-8_L4.4-W3.0-P0.65-LS6.4-BL
  oval 0.353x1.454 smd: 1(-0.975,-2.927) 2(-0.325,-2.927) 3(0.325,-2.927) 4(0.975,-2.927) 5(0.975,2.927) 6(0.325,2.927) 7(-0.325,2.927) 8(-0.975,2.927)

## Nets
As in the schematic.

Pads without a net: SCREW1 1; SCREW2 1; SCREW3 1; SCREW4 1; U1 2 3 4 19; U4 21; U5 21; U7 5

## Via types
v1: diameter 0.61, hole 0.305, Top Layer to Bottom Layer, 266 vias

## Routing (per net, layer and track width the routed paths; a pad name or vN(x,y) marks a point on that pad's centre or on a via; arc(x,y) is an arc through that point)
GND: length 161.5
  Top Layer w0.254: X1.2 30.46,16.04 C8.2 v1(32.54,14.66) ; C3.1 34.65,27.83 U1.23 ; v1(22.61,17.51) C1.2 24.06,17.51 25.08,18.53 X1.4 ; 22.48,23.33 U1.47 24.8,23.33 25.91,24.44 v1(25.91,26.09) ; U1.20 30.74,26.33 v1(29.46,25.06) ; U11.4 v1(69.89,56.32) ; U10.4 v1(37.63,56.19) ; U16.1 43.27,55.56 v1(43.26,55.56) ; v1(10.74,56.32) 10.75,56.33 U15.1 ; 16.89,11.57 17.53,10.94 v1(17.53,10.34)
  Top Layer w0.381: U11.7 71.19,54.48 71.83,55.12 v1(71.83,55.94) 71.84,55.95 U11.1 71.84,58.1 71.21,58.73 41.7,58.73 41.32,58.35 U16.4 v1(41.32,55.94) 41.32,55.13 42.62,53.83 U16.7 ; v1(59.23,39.3) 59.47,39.54 U5.28 ; U5.20 54.27,40.15 54.53,39.88 v1(54.53,39.3) ; U15.1 10.75,58.18 11.27,58.7 38.99,58.7 39.58,58.1 U10.1 39.58,55.95 v1(39.57,55.94) 39.57,55 38.93,54.36 U10.7 ; U5.19 53.62,39.83 v1(53.77,39.68) ; U4.19 20.8,39.83 v1(20.96,39.68) ; v1(21.72,39.3) 21.72,40.06 21.45,40.33 U4.20 ; U15.7 10.1,53.83 8.8,55.13 v1(8.8,55.94) U15.4 ; v1(26.67,39.3) 26.65,39.32 U4.28
  Top Layer w0.508: v1(39.57,55.94) v1(41.32,55.94) ; 4.88,14.89 6.32,14.89 6.86,15.42 6.86,19.23 8.53,20.91 v1(9.21,20.91)
  Top Layer w1.016: U12.5 U2.6
  Top Layer w1.27: SW1.1 26.13,2.09 U8.5 ; U14.5 U12.6 ; U9.5 U8.6 ; U13.5 U14.6
  Bottom Layer w0.254: v1(37.63,56.19) 37.63,55.13 37.97,54.79 39.32,54.79 39.57,55.05 v1(39.57,55.94) ; v1(8.8,55.94) 8.8,55.13 9.14,54.79 10.49,54.79 10.74,55.05 v1(10.74,56.32) ; v1(41.32,55.94) 41.32,55.13 41.66,54.79 43,54.79 43.26,55.05 v1(43.26,55.56) ; v1(69.89,56.32) 69.89,55.13 70.23,54.79 71.58,54.79 71.83,55.05 v1(71.83,55.94)
  vias: v1(1.65,13.64) v1(1.65,12.38) v1(1.78,40.42) v1(1.78,39.17) v1(1.78,31.68) v1(1.78,30.41) v1(1.78,22.65) v1(1.78,21.39) v1(10.03,21.65) v1(10.03,20.91) v1(10.54,10.52) v1(10.54,9.68) v1(11.18,3.87) v1(11.38,10.52) v1(11.38,9.68) v1(15.6,15.6) v1(15.88,47.55) v1(15.88,46.67) v1(15.88,43.74) v1(15.88,42.98) v1(16.13,21.27) v1(16.13,20.55) v1(16.13,19.87) v1(16.64,47.55) v1(16.64,46.67) v1(16.62,43.74) v1(16.62,42.98) v1(16.89,21.27) v1(16.88,20.55) v1(16.88,19.87) v1(19.94,32.44) v1(20.7,32.44) v1(20.7,31.68) v1(20.68,20.68) v1(20.68,10.52) v1(21.59,3.87) v1(22.99,31.68) v1(22.99,30.91) v1(23.77,30.91) v1(25.63,5.82) v1(25.76,10.52) v1(25.91,27.61) v1(25.91,26.89) v1(28.7,25.84) v1(28.7,25.06) v1(30.84,10.52) v1(34.29,26.34) v1(34.96,26.34) v1(35.56,26.73) v1(35.92,5.44) v1(41,5.44) v1(48.69,47.55) v1(48.69,46.67) v1(48.69,43.74) v1(48.69,42.98) v1(49.44,43.74) v1(49.44,42.98) v1(49.45,47.55) v1(49.45,46.67) v1(51.16,20.68) v1(58.12,34.65) v1(58.12,34.02) v1(58.75,34.65) v1(58.75,34.02) v1(59.38,34.65) v1(59.38,34.02)
PGND: length 12.7
  Top Layer w0.762: C14.1 56.04,43.33 U5.29 ; U4.29 23.22,43.33 C13.1
  vias: v1(19.98,44.62) v1(19.98,43.63) v1(24.86,44.62) v1(24.86,43.62) v1(38.48,42.6) v1(38.48,41.97) v1(38.48,41.33) v1(38.48,40.7) v1(38.48,40.06) v1(39.12,42.6) v1(39.12,41.97) v1(39.12,41.33) v1(39.12,40.7) v1(39.12,40.06) v1(39.75,42.6) v1(39.75,41.97) v1(39.75,41.33) v1(39.75,40.7) v1(39.75,40.06) v1(52.76,44.63) v1(52.76,43.64) v1(57.63,44.62) v1(57.63,43.62) v1(75.18,9.84) v1(75.18,9.2) v1(75.18,8.56) v1(75.82,9.84) v1(75.82,9.2) v1(75.82,8.56) v1(76.45,9.84) v1(76.45,9.2) v1(76.45,8.56) v1(77.09,9.84) v1(77.09,9.2) v1(77.09,8.56) v1(77.72,9.84) v1(77.72,9.2) v1(77.72,8.56)
VCC: length 62.2
  Top Layer w0.381: D4.2 1.61,46.16 3.14,44.63 4.06,44.63 4.88,43.82 4.88,41.68 ; v1(17.53,13.14) 17.53,12.21 U7.3 ; D3.2 60.29,27.67 D1.1 ; U3.4 36.01,11.04 34.8,12.25 C19.1 v1(20.7,12.25) ; D5.2 6.91,29.17 4.88,29.17
  Top Layer w0.508: C15.2 57.51,16.06 55.5,16.06
  Top Layer w1.27: 55.5,16.06 50.77,16.06 U6.3 50.56,17.98 53.34,20.76 53.34,23.1 D1.1
  Bottom Layer w0.381: v1(17.53,13.14) 17.91,13.52 19.43,13.52 v1(20.7,12.25)
VCC3.3: length 186.2
  Top Layer w0.254: U1.48 23.05,22.83 C5.2 ; C2.2 25.54,29.8 U1.36 ; U1.1 25.57,20.42 25.05,19.89 C6.2 ; 38.45,18.95 38.45,16.53 v1(37.02,15.11) ; 34.96,18.95 C4.2 ; R1.2 30.23,4.64 v1(30.23,5.64) ; U1.9 29.57,20.33 30.08,19.82 34.04,19.82 34.91,18.95
  Top Layer w0.381: v1(69.9,53.02) 69.9,51.62 U11.5 ; U1.24 33.21,28.33 34.19,29.32 C3.2 ; U15.5 8.8,53.64 v1(8.81,53.65) ; v1(9.45,53.04) 9.45,53.04 U15.6 ; C17.1 38.45,18.95 34.96,18.95 ; v1(70.49,53.65) 70.54,53.59 70.54,51.61
  Top Layer w0.508: C5.2 21.93,21.63 C6.2 21.93,19.45 21.08,18.6 13.46,18.6 12.32,19.74 9.14,19.74 8.13,18.72 8.13,12.88 6.38,11.13 5,11.13 ; 43.71,22.2 43.88,22.37 C18.2 ; C2.2 21.91,34.35 ; C3.2 34.73,34.35
  Top Layer w1.27: U6.4 U6.2 ; U6.4 41.7,22.2 C17.1 ; U6.4 48.26,23.93 50.04,25.71 51.51,25.71 D2.1
  Bottom Layer w0.254: v1(30.23,5.64) 30.68,6.1 33.48,6.1 33.95,6.58 33.95,14.07 34.99,15.11 v1(37.02,15.11)
  Bottom Layer w0.508: v1(41.81,49.71) 41.78,49.74 41.78,52.38 44.58,55.17 68.96,55.17 v1(70.49,53.65) ; v1(9.45,53.04) 10.17,53.04 12.56,55.43 35.18,55.43 37.97,52.63 37.97,50.6 38.86,49.71 v1(40.51,49.71)
  vias: v1(40.77,30.66) v1(40.77,30.03) v1(40.77,29.39) v1(41.15,49.71) v1(41.15,49.01) v1(41.53,30.66) v1(41.53,30.03) v1(41.53,29.36)
VCC12V: length 41
  Top Layer w1.27: C21.1 38.35,46.67 ; 38.35,46.67 37.34,46.67 35.41,44.73 C13.2 ; 38.35,46.67 34.93,50.09 C11.1 ; C12.1 66.19,50.45 68.2,48.44 68.2,44.79 68.14,44.73 C14.2
  vias: v1(17.14,49.84) v1(17.14,49.2) v1(17.78,49.84) v1(17.78,49.2) v1(18.41,49.84) v1(18.41,49.2) v1(19.05,49.84) v1(19.05,49.2) v1(25.02,49.08) v1(25.53,49.46) v1(26.16,49.46) v1(26.8,49.46) v1(27.43,49.46) v1(28.07,49.46)
ADC1_IN0: length 50.7
  Top Layer w0.254: v1(33.66,36.12) 32.38,37.39 v1(32.38,43.59) ; v1(37.97,54.03) 36.83,52.89 v1(36.83,51.24) ; U1.10 30.07,20.63 30.45,20.25 37.21,20.25 38.35,21.39 38.35,23.3 36.96,24.69 v1(36.96,27.61) ; U10.8 v1(39.58,52.89)
  Bottom Layer w0.254: v1(32.38,43.59) 32.38,46.79 v1(36.83,51.24) ; v1(33.66,36.12) 36.83,32.95 36.83,27.74 v1(36.96,27.61) ; v1(39.58,52.89) 39.58,53.44 38.99,54.03 v1(37.97,54.03)
ADC1_IN1: length 43
  Top Layer w0.254: v1(30.58,22.99) 30.57,22.98 U1.11 ; U15.8 v1(10.75,50.35)
  Bottom Layer w0.254: v1(30.58,22.99) 30,23.58 30,24.17 30.1,24.28 30.1,26.09 28.97,27.22 27.94,27.22 27.23,27.93 27.23,28 27.21,28.03 27.21,29.74 21.59,35.36 19.18,35.36 18.8,35.74 18.8,37.14 18.85,37.2 18.85,37.31 19.44,37.89 19.44,38.65 19.43,38.66 19.43,38.66 18.92,39.17 15.75,39.17 10.75,44.17 v1(10.75,50.35)
ADC2_IN4: length 58.7
  Top Layer w0.254: U1.14 34.18,23.33 v1(34.26,23.25) ; U11.8 71.84,44.85 v1(66.01,39.01)
  Bottom Layer w0.254: v1(66.01,39.01) 45.85,18.85 38.66,18.85 v1(34.26,23.25)
ADC2_IN5: length 36.6
  Top Layer w0.254: v1(39.75,34.35) 42.14,34.35 v1(42.59,34.8) ; U1.15 34.51,23.83 34.59,23.75 v1(35.28,23.75) ; U16.8 v1(43.27,49.97)
  Bottom Layer w0.254: v1(39.75,34.35) 38.35,32.95 38.35,24.7 37.46,23.81 35.34,23.81 v1(35.28,23.75) ; v1(43.27,49.97) 42.59,49.29 v1(42.59,34.8)
CAN_H: length 26.6
  Top Layer w0.254: 16.89,16.98 16.89,15.76 17.32,15.32 17.32,14.03 16.33,13.03 16.33,9.37 R2.2 v1(16.48,8.06) 17.02,8.06 17.41,7.67 17.41,6.78 17.66,6.52 22.36,6.52 22.85,6.03 U8.3 ; v1(14,7.49) 13.44,7.49 12.86,6.92 12.86,6.59 12.44,6.16 U9.3
  Bottom Layer w0.254: v1(14,7.49) 14.55,7.49 14.73,7.32 17.23,7.32 17.41,7.5 17.41,7.75 17.1,8.06 v1(16.48,8.06)
CAN_L: length 26.7
  Top Layer w0.254: v1(14,6.73) 13.44,6.73 13.26,6.56 13.69,6.14 U9.4 ; U8.4 24.1,5.42 22.59,6.93 17.99,6.93 17.81,7.11 17.81,7.71 18.16,8.06 v1(18.74,8.06) SW2.2 18.87,9.33 18.87,12.94 17.73,14.08 17.73,15.32 18.16,15.76 U7.6
  Bottom Layer w0.254: v1(14,6.73) 14.55,6.73 14.73,6.91 17.39,6.91 17.81,7.33 17.81,7.75 18.12,8.06 v1(18.74,8.06)
CAN_RX: length 21.6
  Top Layer w0.254: U1.32 27.57,24.01 v1(26.51,22.95) ; 19.43,11.57 19.43,12.88 v1(20.45,13.9)
  Bottom Layer w0.254: v1(26.51,22.95) 21.21,17.65 21.21,14.66 v1(20.45,13.9)
CAN_TX: length 26.6
  Top Layer w0.254: v1(14.61,13.9) 15.62,12.88 U7.1 ; U1.33 27.07,24.59 v1(23.37,20.88)
  Bottom Layer w0.254: v1(23.37,20.88) 20.96,18.47 16.26,18.47 14.61,16.82 v1(14.61,13.9)
I2C1_SCL: length 20.4
  Top Layer w0.254: v1(6.47,21.38) 6.44,21.4 5,21.4 ; v1(13.87,24.46) 14.81,24.46 14.99,24.29 23.02,24.29 23.07,24.33 U1.45
  Bottom Layer w0.254: v1(6.47,21.38) 7.48,21.38 10.39,24.29 13.51,24.29 13.69,24.46 v1(13.87,24.46)
I2C1_SDA: length 20.8
  Top Layer w0.254: v1(6.47,20.15) 5,20.15 ; v1(13.87,23.7) 14.81,23.7 14.99,23.88 23.02,23.88 23.07,23.83 U1.46
  Bottom Layer w0.254: v1(13.87,23.7) 13.69,23.7 13.51,23.88 10.74,23.88 7.02,20.15 v1(6.47,20.15)
I2C2_SCL: length 34.2
  Top Layer w0.254: v1(19.44,37.06) 18.88,37.06 18.7,36.89 18.15,36.89 17.82,36.56 17.34,36.56 17.01,36.89 8.45,36.89 6.15,39.18 4.88,39.18 ; v1(28.21,28.42) 29.8,26.83 U1.21
  Bottom Layer w0.254: v1(19.44,37.06) 21.16,37.06 28.21,30.01 v1(28.21,28.42)
I2C2_SDA: length 33.7
  Top Layer w0.254: v1(19.44,36.3) 18.88,36.3 18.7,36.48 18.32,36.48 17.99,36.15 17.17,36.15 16.84,36.48 8.28,36.48 6.83,37.93 4.88,37.93 ; v1(30.02,27.63) 31.25,27.63 31.54,27.33 U1.22
  Bottom Layer w0.254: v1(19.44,36.3) 19.62,36.48 19.68,36.48 19.83,36.63 20.96,36.63 27.62,29.97 27.62,28.19 28.18,27.63 v1(30.02,27.63)
M1_A: length 6.5
  Top Layer w0.254: U10.3 38.28,55.99 37.47,55.17 35.98,55.17 R5.1
M1_A_P: length 7.5
  Top Layer w0.254: U10.2 38.93,56.01 35.5,52.57 R5.2
M1_B: length 10.4
  Top Layer w0.254: R12.1 13.84,54.67 v1(13.33,54.16) ; v1(11.3,53.14) 10.67,53.78 10.67,54.28 9.45,55.5 U15.3
  Bottom Layer w0.254: v1(11.3,53.14) 12.32,53.14 v1(13.33,54.16)
M1_B_P: length 6.7
  Top Layer w0.254: U15.2 10.1,55.95 13.48,52.57 R12.2
M1_C:
  vias: v1(21.13,49.38) v1(21.13,48.69)
M1_EN: length 20.7
  Top Layer w0.254: U1.28 29.57,31.6 29.72,31.75 v1(29.72,32.44) ; 24.05,42.14 23.79,42.4 23.04,42.4 22.75,42.11 U4.22 ; 24.05,42.14 24.05,41.26 ; 24.05,42.14 24.31,42.4 25.09,42.4 25.35,42.14 25.35,37.57 v1(25.65,37.27)
  Bottom Layer w0.254: v1(25.65,37.27) 28.57,37.27 29.72,36.12 v1(29.72,32.44)
M1_FAULT: length 25.2
  Top Layer w0.254: v1(17.58,37.14) R3.2 18.02,38.29 18.67,37.65 19.43,37.65 20.15,38.37 U4.18 ; v1(17.62,26.31) 18.22,25.71 20.7,25.71 21.82,26.83 U1.40
  Bottom Layer w0.254: v1(17.62,26.31) 17.58,26.34 v1(17.58,37.14)
M1_RESET: length 21.4
  Top Layer w0.254: U1.41 22.21,26.33 v1(21.72,25.84) ; U4.16 v1(18.85,38.41)
  Bottom Layer w0.254: v1(18.85,38.41) 18.17,37.72 18.17,26.59 18.92,25.84 v1(21.72,25.84)
M1_SLEEP: length 25.3
  Top Layer w0.254: U1.13 31.68,22.83 v1(30.58,23.93) ; v1(19.5,39.55) U4.17
  Bottom Layer w0.254: v1(19.5,39.55) 19.5,39.42 26.75,32.17 28.33,32.17 30.61,29.9 30.61,23.96 v1(30.58,23.93)
M2_A: length 6.6
  Top Layer w0.254: 70.54,57.47 70.54,55.74 69.6,54.79 68.97,54.79 66.94,56.82
M2_A_P: length 7.4
  Top Layer w0.254: U11.2 71.19,55.5 68.23,52.54 R6.2
M2_B: length 10.6
  Top Layer w0.254: v1(45.97,54.03) 46.35,54.41 R13.1 ; v1(43.81,53.27) 43.56,53.27 43.31,53.52 43.31,54.03 41.97,55.37 U16.3
  Bottom Layer w0.254: v1(43.81,53.27) 45.21,53.27 v1(45.97,54.03)
M2_B_P: length 7
  Top Layer w0.254: R13.2 45.4,52.57 42.62,55.36 U16.2
M2_C:
  vias: v1(53.95,49.38) v1(53.95,48.69)
M2_EN: length 45.4
  Top Layer w0.254: v1(54.23,38.16) 55.57,39.5 U5.22 55.57,42.04 55.95,42.42 56.4,42.42 56.65,42.17 56.84,42.17 ; U5.24 56.84,41.29 56.84,42.17 ; v1(32.38,32.69) 31.24,32.69 30.07,31.53 U1.27 ; 56.84,42.17 57.1,42.17 57.35,42.42 57.84,42.42 58.17,42.09 U5.26 ; v1(35.56,32.69) 36.37,32.69 v1(39.27,29.8)
  Bottom Layer w0.254: v1(39.27,29.8) 39.82,29.24 39.82,28.97 40.21,28.59 51.39,28.59 54.23,31.42 v1(54.23,38.16) ; v1(35.56,32.69) 35.55,32.7 32.39,32.7 v1(32.38,32.69)
M2_FAULT: length 38.2
  Top Layer w0.254: U5.18 52.97,39.18 52.07,38.28 47.35,38.28 R4.2 45.98,38.29 v1(45.97,38.28) ; v1(36.32,22.03) 35.63,21.33 U1.12 ; v1(45.21,25.89) 44.78,25.46 v1(42.37,25.46) ; v1(45.21,29.27) v1(45.21,27.87)
  Bottom Layer w0.254: v1(36.32,22.03) 36.63,22.33 36.63,22.4 39.69,25.46 v1(42.37,25.46) ; v1(45.97,38.28) 45.21,37.52 v1(45.21,29.27) ; v1(45.21,27.87) v1(45.21,25.89)
M2_RESET: length 36.3
  Top Layer w0.254: U1.26 30.57,31.14 31.37,31.93 v1(32.38,31.93) ; U5.16 v1(51.67,39.05) ; v1(49.53,29.27) 47.5,27.23 v1(42.8,27.23) ; v1(39.45,28.12) v1(35.64,31.93)
  Bottom Layer w0.254: v1(49.53,29.27) 51.67,31.41 v1(51.67,39.05) ; v1(42.8,27.23) 40.34,27.23 v1(39.45,28.12) ; v1(35.64,31.93) v1(32.38,31.93)
M2_SLEEP: length 36.4
  Top Layer w0.254: U5.17 52.32,41.25 v1(52.32,39.68) ; v1(50.93,29.27) 48.13,26.47 v1(42.8,26.47) ; v1(32.38,30.98) 31.56,30.98 31.07,30.49 U1.25 ; v1(35.5,31.04) 35.56,31.04 v1(39.45,27.16)
  Bottom Layer w0.254: v1(39.45,27.16) 40.13,26.47 v1(42.8,26.47) ; v1(52.32,39.68) 52.32,30.66 v1(50.93,29.27) ; v1(32.38,30.98) 32.45,31.04 v1(35.5,31.04)
NRST: length 26.2
  Top Layer w0.254: 31.78,4.59 SW1.2 33.75,2.09 C7.2 ; 31.78,4.59 R1.1 ; 31.78,4.59 32.76,5.58 v1(32.76,6.79) ; U1.7 28.57,20.38 v1(28.96,20)
  Bottom Layer w0.254: v1(32.76,6.79) 33.4,7.42 33.4,15.17 33.78,15.55 33.78,18.47 32.26,20 v1(28.96,20)
OSC_IN: length 8.2
  Top Layer w0.254: U1.5 27.57,17.43 X1.1 23.86,16.13 C1.1
OSC_OUT: length 7.6
  Top Layer w0.254: C8.1 32.54,17.8 31.88,18.47 30.43,18.47 X1.3 28.65,18.53 28.07,19.1 U1.6
SWCLK: length 27.8
  Top Layer w0.254: 5,13.64 5.01,13.64 v1(6.48,13.64) ; v1(14.61,25.58) 14.83,25.81 14.83,25.88 17.54,28.58 17.6,28.58 17.78,28.76 22.35,28.76 22.78,28.33 U1.37
  Bottom Layer w0.254: v1(14.61,25.58) 14.61,21.77 v1(6.48,13.64)
SWDIO: length 32.2
  Top Layer w0.254: v1(23.11,29.14) 25.06,29.14 25.4,28.8 26.24,28.8 26.57,29.13 U1.34 ; v1(15.24,25.08) 15.24,25.71 17.7,28.17 v1(20.19,28.17) ; v1(6.48,12.38) 5.01,12.38 5,12.39
  Bottom Layer w0.254: v1(15.24,25.08) 15.24,21.14 v1(6.48,12.38) ; v1(23.11,29.14) 22.35,29.14 21.39,28.17 v1(20.19,28.17)
TIM1_CH1: length 13.3
  Top Layer w0.254: U4.27 26,37.93 27.43,36.5 v1(28.45,36.5) ; U1.29 29.08,29.84 v1(29.08,32.95)
  Bottom Layer w0.254: v1(28.45,36.5) 29.08,35.87 v1(29.08,32.95)
TIM1_CH2: length 13.6
  Top Layer w0.254: U1.30 28.57,29.84 28.57,31.81 28.07,32.31 v1(28.07,32.95) ; v1(26.54,36.38) 25.65,36.38 24.7,37.33 U4.25
  Bottom Layer w0.254: v1(26.54,36.38) 28.07,34.85 v1(28.07,32.95)
TIM1_CH3: length 13.4
  Top Layer w0.254: v1(25.02,36.12) 23.4,37.74 U4.23 ; U1.31 28.07,29.84 28.07,31.57 27.05,32.59 v1(27.05,32.95)
  Bottom Layer w0.254: v1(27.05,32.95) 27.05,34.09 v1(25.02,36.12)
TIM2_CH1: length 29.4
  Top Layer w0.254: v1(6.1,44.25) 6.04,44.3 R16.1 ; v1(14.1,34.47) v1(12.83,35.74) ; v1(16.89,31.68) 18.29,31.68 v1(18.92,31.04) ; v1(20.96,27.49) 21.3,27.83 U1.38
  Bottom Layer w0.254: v1(18.92,31.04) 19.34,30.63 19.34,28.21 20.05,27.49 v1(20.96,27.49) ; v1(14.1,34.47) v1(16.89,31.68) ; v1(12.83,35.74) 6.1,42.47 v1(6.1,44.25)
TIM2_CH2: length 21.4
  Top Layer w0.254: v1(15.49,30.16) 18.37,30.16 v1(18.75,29.77) ; U1.39 21.69,27.33 21.21,26.85 19.69,26.85 v1(19.05,27.49) ; v1(12.7,32.95) 11.68,32.95 10.92,32.19 10.92,30.79 10.41,30.28 10.41,29.47 R17.1
  Bottom Layer w0.254: v1(19.05,27.49) 18.75,27.79 v1(18.75,29.77) ; v1(12.7,32.95) v1(15.49,30.16)
TIM3_CH1: length 42.4
  Top Layer w0.254: U5.27 58.82,39.83 v1(57.15,38.16) ; U1.16 35.54,24.33 37.21,22.66 v1(37.21,22.15)
  Bottom Layer w0.254: v1(57.15,38.16) 57.15,30.92 45.97,19.74 39.62,19.74 v1(37.21,22.15)
TIM3_CH2: length 37.4
  Top Layer w0.254: v1(39.49,24.18) 38.82,24.85 v1(37.62,24.85) ; U5.25 57.52,39.42 v1(56.26,38.16) ; v1(36.32,24.82) 36.31,24.83 U1.17
  Bottom Layer w0.254: v1(56.26,38.16) 56.26,31.3 49.14,24.18 v1(39.49,24.18) ; v1(37.62,24.85) 36.35,24.85 v1(36.32,24.82)
TIM3_CH3: length 36.2
  Top Layer w0.254: v1(36.32,25.71) 35.94,25.33 32.57,25.33 U1.18 ; v1(39.93,24.82) 39.04,25.71 v1(37.72,25.71) ; U5.23 56.22,39.13 v1(55.25,38.16)
  Bottom Layer w0.254: v1(55.25,38.16) 55.25,31.3 48.77,24.82 v1(39.93,24.82) ; v1(37.72,25.71) v1(36.32,25.71)
USART1_RX: length 25.1
  Top Layer w0.254: v1(16,25.2) 16.38,24.82 22.48,24.82 22.99,25.33 24.07,25.33 U1.43 ; v1(8.38,34.47) 7.49,34.47 5.94,32.92 4.88,32.92
  Bottom Layer w0.254: v1(8.38,34.47) 9.95,32.91 9.95,32.71 10.29,32.37 10.49,32.37 15.24,27.61 15.24,25.96 v1(16,25.2)
USART1_TX: length 25.8
  Top Layer w0.254: v1(16.56,25.72) 17.02,25.25 22.15,25.25 22.73,25.83 U1.42 ; v1(9.89,34.6) 9.34,34.6 8.45,33.71 7.49,33.71 5.45,31.67 4.88,31.67
  Bottom Layer w0.254: v1(16.56,25.72) 15.77,26.5 15.77,28.72 v1(9.89,34.6)
$1N3655: length 15.3
  Top Layer w0.254: R2.1 v1(13.33,9.22) ; v1(24.38,9.2) SW2.1
  Bottom Layer w0.254: v1(24.38,9.2) 24.37,9.22 v1(13.33,9.22)
$1N7193: length 3.9
  Top Layer w0.254: U4.1 30.28,46.99 C9.2
$1N7199: length 7.8
  Top Layer w0.254: C9.1 31.89,47.28 31.5,47.68 30.61,47.68 30.1,48.19 26.29,48.19 26,47.9 U4.2
$1N7239: length 7.2
  Top Layer w0.254: C11.2 25.86,48.69 25.35,48.19 25.35,46.99
$1N7723: length 4.8
  Top Layer w0.254: U4.15 18.2,40.48 17.78,40.06 16.1,40.06 C22.2 16.08,40.04 R3.1
$1N8422: length 5.2
  Top Layer w0.254: U5.1 59.47,47.72 59.82,48.06 62.1,48.06 62.83,47.33 C10.2
$1N8426: length 8
  Top Layer w0.254: U5.2 58.82,48.08 59.28,48.54 62.38,48.54 62.99,47.94 63.88,47.94 64.23,47.58 C10.1
$1N8429: length 7.1
  Top Layer w0.254: U5.3 58.17,48.45 58.67,48.95 63.41,48.95 C12.2
$1N8490: length 4.7
  Top Layer w0.254: U5.15 51.02,40.52 50.55,40.04 C23.2 47.58,40.04 R4.1
$1N11780: length 1.7
  Top Layer w0.381: R9.1 61.05,31.77 D3.1
$1N11915: length 9.8
  Top Layer w0.381: v1(9.65,24.95) 8.53,23.82 R15.2 ; v1(9.65,30.16) 9.65,31.47 Q2.3
  Bottom Layer w0.381: v1(9.65,24.95) v1(9.65,30.16)
$1N11916: length 1.7
  Top Layer w0.381: D5.1 6.98,27.49 R15.1
$1N11923: length 7.1
  Top Layer w0.381: Q2.1 8.51,31.53 8.51,27.11 8.91,26.71 R17.2
$1N12054: length 2.1
  Top Layer w0.381: Q1.3 4.95,50.86 4.59,51.21 R14.2
$1N12055: length 1.9
  Top Layer w0.381: D4.1 1.61,51.17 R14.1
$1N12058: length 1.9
  Top Layer w0.381: Q1.1 4.04,47.94 R16.2

## Copper pours and planes (outline as drawn; the poured copper is in the pictures)
GND on Top Layer: 5.17,52.97 6.86,54.67 6.86,59.42 7.43,60 8.38,60 9.14,59.24 9.14,55.3 10.41,54.03 10.41,45.01 10.8,44.63 12.32,44.63 12.57,44.89 12.57,47.94 13.08,48.44 19.08,48.44 19.74,47.78 19.74,46.18 19.58,46.03 15.53,46.03 14.02,44.53 14.02,43.29 10.8,40.06 10.8,35.62 11.3,35.11 61.98,35.11 62.61,34.47 62.61,27.74 60.83,25.96 60.83,18.22 56.51,13.9 53.47,13.9 52.58,13.14 52.58,9.07 51.56,8.06 43.69,8.06 41.78,6.15 41.78,1.2 38.23,-2.36 10.29,-2.36 7.37,0.56 7.37,6.53 6.22,7.68 -0.89,7.68 -1.14,7.93 -1.14,51.87 -0.04,52.97
GND on Top Layer: 48.25,44.07 49.78,44.07 49.78,40.82 48.25,40.82
GND on Top Layer: 15.43,44.12 16.97,44.12 16.97,40.82 15.43,40.82
GND on Top Layer: 48.25,47.94 52.55,47.94 52.55,46.03 48.25,46.03
GND on Top Layer: 15.43,47.94 19.74,47.94 19.74,46.03 15.43,46.03
GND on Bottom Layer: 5.17,52.97 6.86,54.67 6.86,59.42 7.43,60 8.38,60 9.14,59.24 9.14,55.3 10.41,54.03 10.41,45.01 10.8,44.63 12.32,44.63 12.57,44.89 12.57,47.94 13.08,48.44 19.08,48.44 19.74,47.78 19.74,46.18 19.58,46.03 15.53,46.03 14.02,44.53 14.02,43.29 10.8,40.06 10.8,35.62 11.3,35.11 61.98,35.11 62.61,34.47 62.61,27.74 60.83,25.96 60.83,18.22 56.51,13.9 53.47,13.9 52.58,13.14 52.58,9.07 51.56,8.06 43.69,8.06 41.78,6.15 41.78,1.2 38.23,-2.36 10.29,-2.36 7.37,0.56 7.37,6.53 6.22,7.68 -0.89,7.68 -1.14,7.93 -1.14,51.87 -0.04,52.97
GND on Bottom Layer: 15.43,47.94 27.18,47.94 27.18,38.92 15.43,38.92
GND on Bottom Layer: 48.25,47.94 59.74,47.94 59.74,38.92 48.25,38.92
GND on Bottom Layer: 57.66,40.19 59.74,40.19 59.74,33.58 57.66,33.58
PGND on Top Layer: 53.42,47.91 53.82,47.91 53.82,45.39 53.42,45.39
PGND on Top Layer: 20.6,47.76 21.01,47.76 21.01,45.24 20.6,45.24
PGND on Top Layer: 55.34,47.94 56.46,47.94 56.46,45.32 55.34,45.32
PGND on Top Layer: 43.31,45.85 57.15,45.85 57.15,39.5 43.31,39.5
PGND on Top Layer: 10.9,45.78 19.56,45.78 19.56,39.43 10.9,39.43
PGND on Top Layer: 58.37,43.11 78.99,43.11 78.99,1.43 58.37,1.43
PGND on Top Layer: 38.1,43.11 44.63,43.11 44.63,39.5 38.1,39.5
PGND on Top Layer: 22.53,47.89 23.62,47.89 23.62,45.21 22.53,45.21
PGND on Top Layer: 53.37,5.26 61.72,5.26 61.72,1.43 53.37,1.43
PGND on Bottom Layer: 19.3,45.52 40.14,45.52 40.14,39.55 19.3,39.55
PGND on Bottom Layer: 52.07,45.52 73.79,45.52 73.79,37.01 52.07,37.01
PGND on Bottom Layer: 58.17,43.11 78.99,43.11 78.99,1.45 58.17,1.45
VCC on Top Layer: 2.93,24.31 10.4,24.31 10.4,4.15 2.93,4.15
VCC on Top Layer: 35.81,17.58 51.18,17.58 51.18,9.84 35.81,9.84
VCC on Top Layer: 19.94,12.25 40,12.25 40,2.34 19.94,2.34
VCC on Top Layer: 9.53,5.92 20.75,5.92 20.75,2.34 9.53,2.34
VCC on Top Layer: 2.83,42.09 5.97,42.09 5.97,23.42 2.83,23.42
VCC3.3 on Top Layer: 40.39,26.09 41.91,26.09 41.91,19.87 40.39,19.87
VCC3.3 on Top Layer: 37.47,52.38 42.14,52.38 42.14,48.7 37.47,48.7
VCC3.3 on Top Layer: 10.92,35.62 41.91,35.62 41.91,19.51 10.92,19.51
VCC3.3 on Bottom Layer: 40.13,50.09 42.16,50.09 42.16,29.01 40.13,29.01
VCC3.3 on Bottom Layer: 8.49,54 9.78,54 9.78,52.71 8.49,52.71
VCC3.3 on Bottom Layer: 69.57,53.98 70.82,53.98 70.82,52.69 69.57,52.69
VCC12V on Top Layer: 60.96,35.74 75.95,35.74 75.95,13.01 60.96,13.01
VCC12V on Top Layer: 24.49,50.83 31.95,50.83 31.95,46.08 24.49,46.08
VCC12V on Top Layer: 66.07,37.52 72.9,37.52 72.9,32.14 66.07,32.14
VCC12V on Top Layer: 62.91,45.65 68.83,45.65 68.83,35.36 62.91,35.36
VCC12V on Top Layer: 35.43,48.44 68.45,48.44 68.45,35.28 35.43,35.28
VCC12V on Top Layer: 10.92,50.22 20.37,50.22 20.37,44.76 10.92,44.76
VCC12V on Top Layer: 43.31,49.33 53.19,49.33 53.19,44.76 43.31,44.76
VCC12V on Top Layer: 53.37,17.84 66.04,17.84 66.04,6.62 53.37,6.62
VCC12V on Top Layer: 57.3,51.08 64.13,51.08 64.13,46.08 57.3,46.08
VCC12V on Bottom Layer: 16.76,50.22 28.52,50.22 28.52,46.08 16.76,46.08
M1_A on Top Layer: 25.53,57.71 36.26,57.71 36.26,51.49 25.53,51.49
M1_A_P on Top Layer: 23.82,53.27 36.27,53.27 36.27,46.08 23.82,46.08
M1_B on Top Layer: 11.75,57.72 25.02,57.72 25.02,51.49 11.75,51.49
M1_B_P on Top Layer: 11.96,53.27 22.35,53.27 22.35,45.95 11.96,45.95
M1_C on Top Layer: 20.78,49.71 21.69,49.71 21.69,45.9 20.78,45.9
M1_C on Bottom Layer: 20.4,53.4 22.43,53.4 22.43,48.12 20.4,48.12
M2_A on Top Layer: 58.17,57.71 68.9,57.71 68.9,51.49 58.17,51.49
M2_A_P on Top Layer: 56.64,53.27 69.09,53.27 69.09,46.08 56.64,46.08
M2_B on Top Layer: 44.39,57.72 57.66,57.72 57.66,51.49 44.39,51.49
M2_B_P on Top Layer: 44.39,53.4 55.17,53.4 55.17,45.95 44.39,45.95
M2_C on Top Layer: 53.59,49.71 54.51,49.71 54.51,45.9 53.59,45.9
M2_C on Bottom Layer: 52.96,53.4 55.12,53.4 55.12,48.12 52.96,48.12

Small or netless copper shapes (teardrops, artwork), in the pictures only: 366 on Top Layer, 119 on Bottom Layer

## Text on the board
Bottom Silkscreen Layer: CLK | SCL | SDA | DIO | + | G | H | CAN | L | C | B | M1 | A | M2 | - | I2C2 | USART1 | I2C1 | SWD | T | R
Top Silkscreen Layer: M1 | C | B | A | M2
